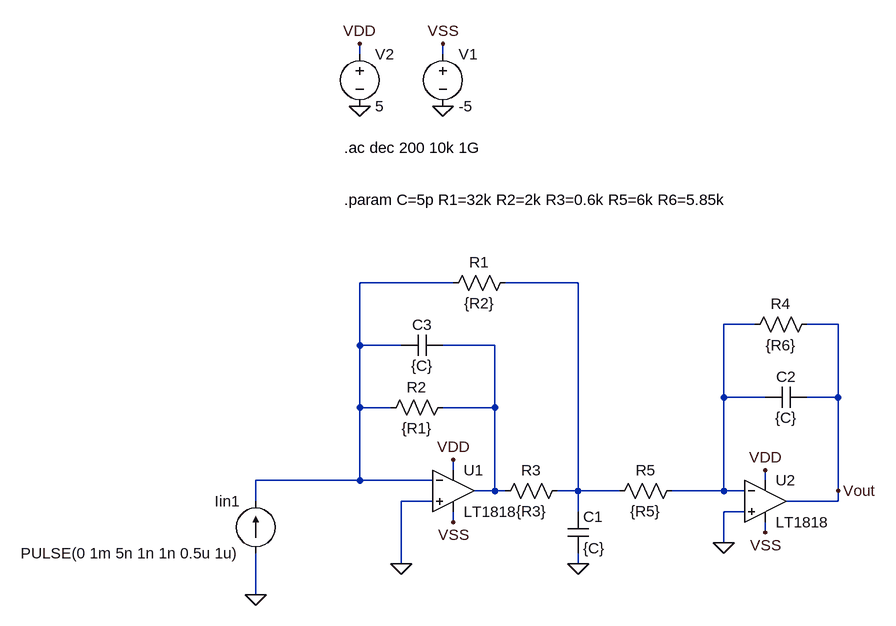
[diagram p0: schematic TIA-ALL_Z-LPF-AC.asc]
TIA-ALL_Z-LPF-AC.asc, the LTspice schematic file:
Version 4
SHEET 1 1008 800
WIRE 256 -48 256 -64
WIRE 384 -48 384 -64
WIRE 400 304 256 304
WIRE 592 304 480 304
WIRE 864 368 816 368
WIRE 992 368 944 368
WIRE 256 400 256 304
WIRE 320 400 256 400
WIRE 464 400 384 400
WIRE 816 480 816 368
WIRE 880 480 816 480
WIRE 992 480 992 368
WIRE 992 480 944 480
WIRE 256 496 256 400
WIRE 304 496 256 496
WIRE 464 496 464 400
WIRE 464 496 384 496
WIRE 400 592 400 576
WIRE 256 608 256 496
WIRE 256 608 96 608
WIRE 368 608 256 608
WIRE 880 608 880 592
WIRE 464 624 464 496
WIRE 464 624 432 624
WIRE 480 624 464 624
WIRE 592 624 592 304
WIRE 592 624 560 624
WIRE 656 624 592 624
WIRE 816 624 816 480
WIRE 816 624 736 624
WIRE 848 624 816 624
WIRE 992 624 992 480
WIRE 96 640 96 608
WIRE 368 640 320 640
WIRE 992 640 992 624
WIRE 992 640 912 640
WIRE 592 656 592 624
WIRE 848 656 816 656
WIRE 400 672 400 656
WIRE 880 688 880 672
WIRE 816 704 816 656
WIRE 320 736 320 640
WIRE 592 736 592 720
WIRE 96 784 96 720
FLAG 384 32 0
FLAG 256 32 0
FLAG 256 -64 VDD
FLAG 384 -64 VSS
FLAG 96 784 0
FLAG 320 736 0
FLAG 592 736 0
FLAG 816 704 0
FLAG 880 592 VDD
FLAG 880 688 VSS
FLAG 400 576 VDD
FLAG 400 672 VSS
FLAG 992 624 Vout
SYMBOL voltage 384 -64 R0
WINDOW 123 0 0 Left 0
WINDOW 39 0 0 Left 0
SYMATTR InstName V1
SYMATTR Value -5
SYMBOL voltage 256 -64 R0
WINDOW 123 0 0 Left 0
WINDOW 39 0 0 Left 0
SYMATTR InstName V2
SYMATTR Value 5
SYMBOL LT1818 400 624 R0
SYMATTR InstName U1
SYMBOL current 96 720 R180
WINDOW 0 24 80 Left 2
WINDOW 3 24 0 Left 2
WINDOW 39 0 0 Left 0
SYMATTR InstName Iin1
SYMATTR Value PULSE(0 1m 5n 1n 1n 0.5u 1u)
SYMATTR Value2 AC 1
SYMBOL Cap 576 656 R0
SYMATTR InstName C1
SYMATTR Value {C}
SYMBOL Cap 944 464 R90
WINDOW 0 0 32 VBottom 2
WINDOW 3 32 32 VTop 2
SYMATTR InstName C2
SYMATTR Value {C}
SYMBOL Cap 384 384 R90
WINDOW 0 0 32 VBottom 2
WINDOW 3 32 32 VTop 2
SYMATTR InstName C3
SYMATTR Value {C}
SYMBOL Res 496 288 R90
WINDOW 0 0 56 VBottom 2
WINDOW 3 32 56 VTop 2
SYMATTR InstName R1
SYMATTR Value {R2}
SYMBOL Res 400 480 R90
WINDOW 0 0 56 VBottom 2
WINDOW 3 32 56 VTop 2
SYMATTR InstName R2
SYMATTR Value {R1}
SYMBOL Res 576 608 R90
WINDOW 0 0 56 VBottom 2
WINDOW 3 32 56 VTop 2
SYMATTR InstName R3
SYMATTR Value {R3}
SYMBOL Res 960 352 R90
WINDOW 0 0 56 VBottom 2
WINDOW 3 32 56 VTop 2
SYMATTR InstName R4
SYMATTR Value {R6}
SYMBOL Res 752 608 R90
WINDOW 0 0 56 VBottom 2
WINDOW 3 32 56 VTop 2
SYMATTR InstName R5
SYMATTR Value {R5}
SYMBOL LT1818 880 640 R0
SYMATTR InstName U2
TEXT 232 96 Left 2 !.ac dec 200 10k 1G
TEXT 232 176 Left 2 !.param C=5p R1=32k R2=2k R3=0.6k R5=6k R6=5.85k

The netlist it stands for:
* TIA-ALL_Z-LPF-AC.asc
V1 VSS 0 -5
V2 VDD 0 5
XU1 0 N001 N004 VDD VSS LT1818  ; pins In+ In- OUT V+ V-
Iin1 0 N001 PULSE(0 1m 5n 1n 1n 0.5u 1u) AC 1
C1 N002 0 {C}
C2 Vout N003 {C}
C3 N004 N001 {C}
R1 N002 N001 {R2}
R2 N004 N001 {R1}
R3 N002 N004 {R3}
R4 Vout N003 {R6}
R5 N003 N002 {R5}
XU2 0 N003 Vout VDD VSS LT1818  ; pins In+ In- OUT V+ V-
.ac dec 200 10k 1G
.param C=5p R1=32k R2=2k R3=0.6k R5=6k R6=5.85k
.lib LTC2.lib
.backanno
.end